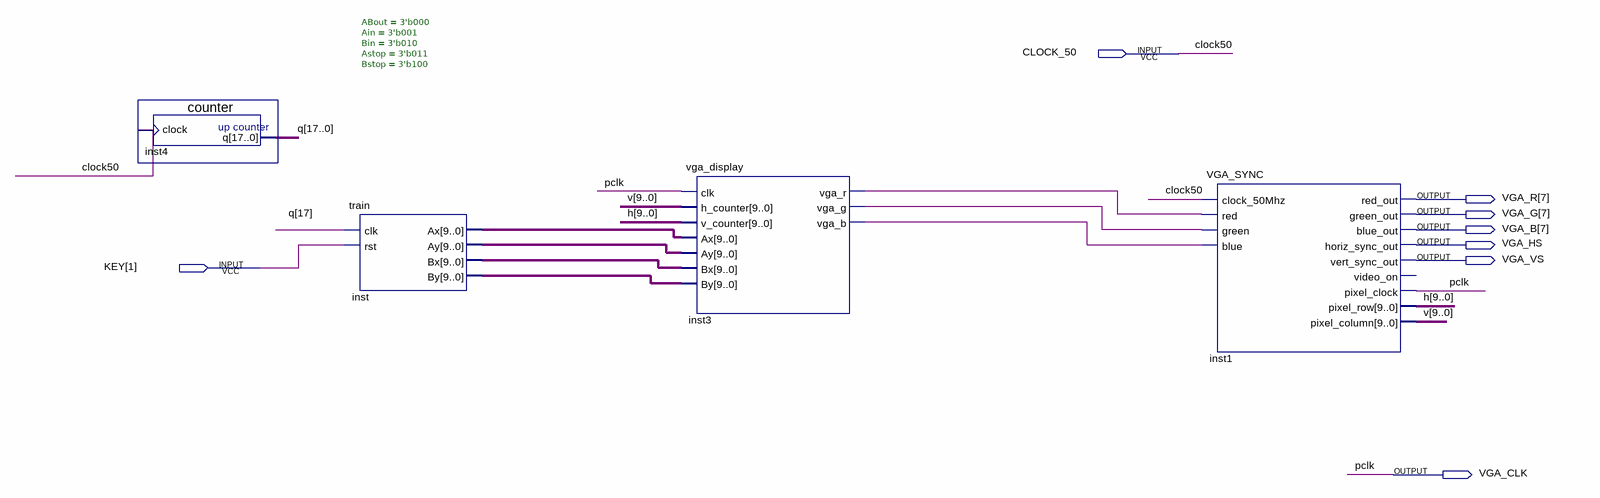
[diagram p0: schematic sheet]
// Quartus schematic train_block.bdf as structural Verilog: 4 symbols, 8 pins
module train_block (
  input  CLOCK_50,
  input  [1:1] KEY,
  output [7:7] VGA_R,
  output [7:7] VGA_G,
  output [7:7] VGA_B,
  output VGA_HS,
  output VGA_VS,
  output VGA_CLK
);

  wire inst3_vga_b, inst3_vga_g, inst3_vga_r;
  wire [9:0] h, inst_ax, inst_ay, inst_bx, inst_by, v;
  wire [17:0] q;

  counter inst4 (.clock(CLOCK_50), .q(q));
  train #(.ABout(3'b000), .Ain(3'b001), .Bin(3'b010), .Astop(3'b011), .Bstop(3'b100)) inst (
    .clk(q[17]), .rst(KEY[1]), .Ax(inst_ax), .Ay(inst_ay), .Bx(inst_bx), .By(inst_by));
  vga_display inst3 (
    .clk(VGA_CLK), .h_counter(v), .v_counter(h), .Ax(inst_ax), .Ay(inst_ay), .Bx(inst_bx), .By(inst_by),
    .vga_r(inst3_vga_r), .vga_g(inst3_vga_g), .vga_b(inst3_vga_b));
  VGA_SYNC inst1 (
    .clock_50Mhz(CLOCK_50), .red(inst3_vga_r), .green(inst3_vga_g), .blue(inst3_vga_b), .red_out(VGA_R[7]),
    .green_out(VGA_G[7]), .blue_out(VGA_B[7]), .horiz_sync_out(VGA_HS), .vert_sync_out(VGA_VS),
    .pixel_clock(VGA_CLK), .pixel_row(h), .pixel_column(v));  // open: video_on

  // Other names for the same wires on the sheet: clock50 = CLOCK_50; pclk = VGA_CLK
endmodule
